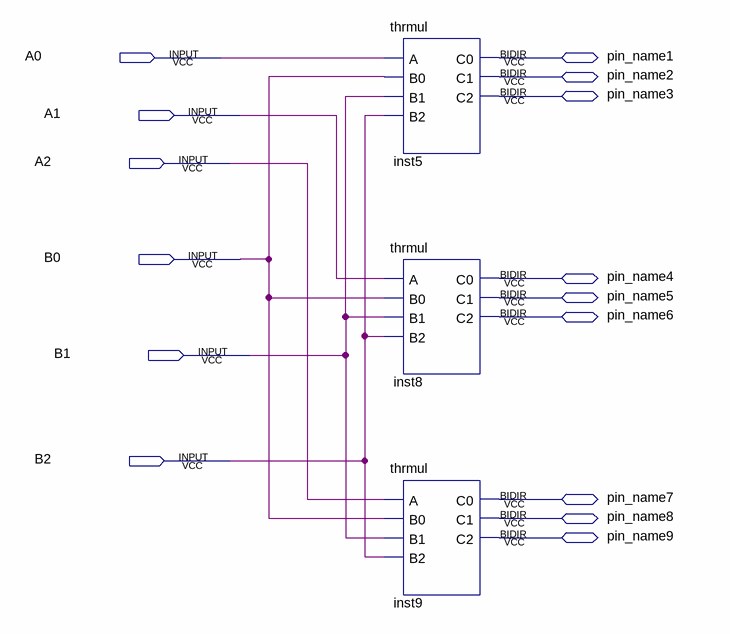
[diagram p0: schematic sheet]
// Quartus schematic txtmul.bdf as structural Verilog: 3 symbols, 15 pins
module txtmul (
  input  A0,
  input  A1,
  input  A2,
  input  B0,
  input  B1,
  input  B2,
  inout  pin_name1,
  inout  pin_name2,
  inout  pin_name3,
  inout  pin_name4,
  inout  pin_name5,
  inout  pin_name6,
  inout  pin_name7,
  inout  pin_name8,
  inout  pin_name9
);

  thrmul inst5 (.A(A0), .B0(B0), .B1(B1), .B2(B2), .C0(pin_name1), .C1(pin_name2), .C2(pin_name3));
  thrmul inst8 (.A(A1), .B0(B0), .B1(B1), .B2(B2), .C0(pin_name4), .C1(pin_name5), .C2(pin_name6));
  thrmul inst9 (.A(A2), .B0(B0), .B1(B1), .B2(B2), .C0(pin_name7), .C1(pin_name8), .C2(pin_name9));
endmodule
